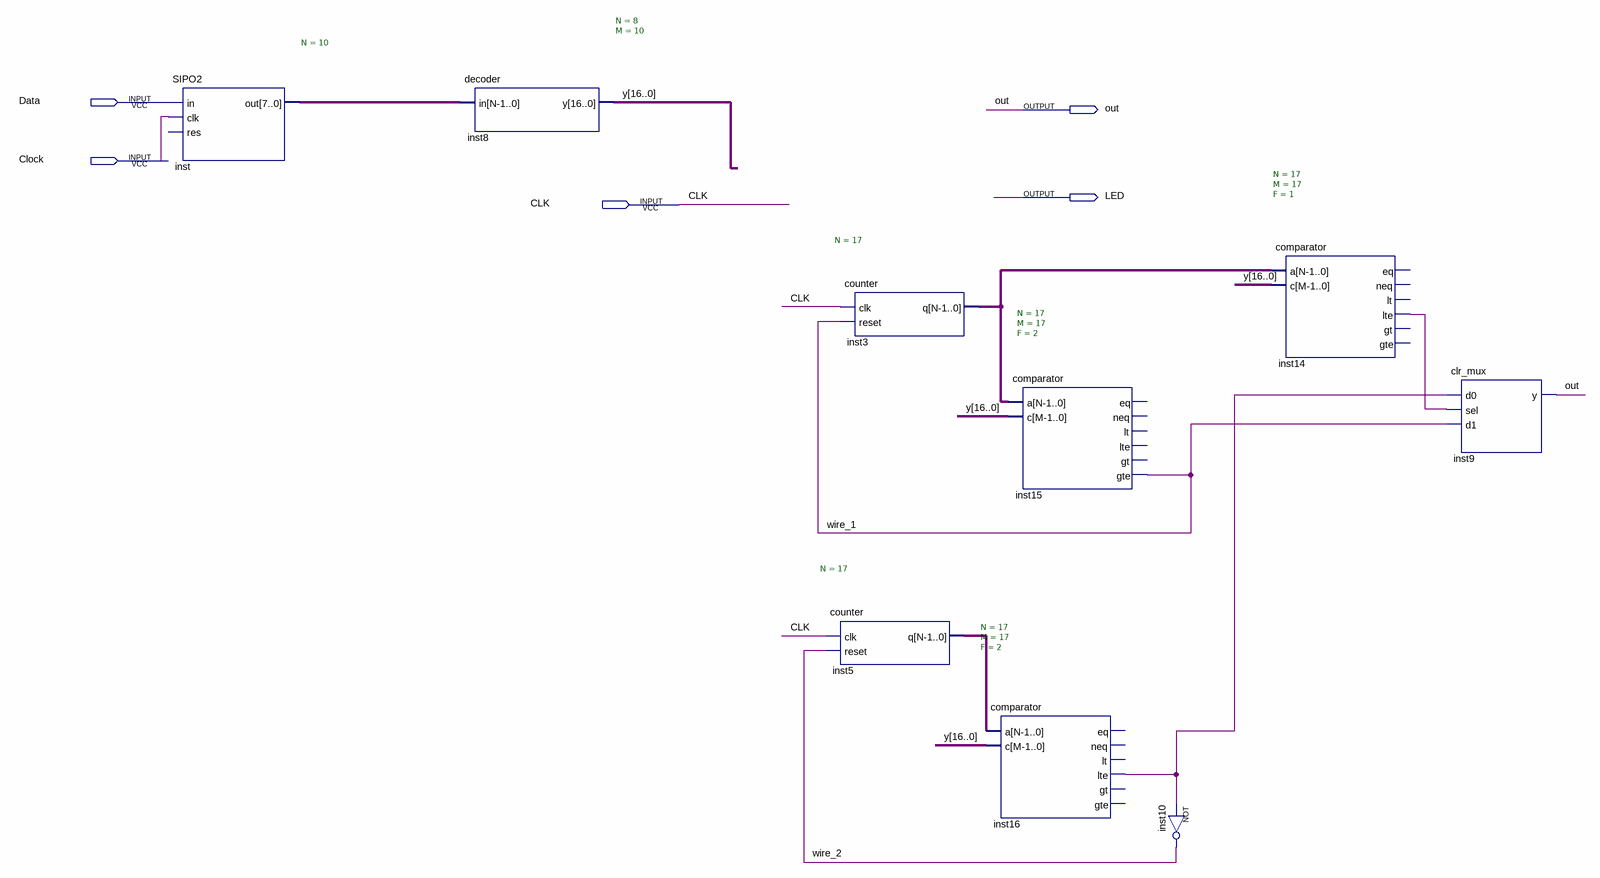
[diagram p0: schematic sheet]
// Quartus schematic Top_Level2.bdf as structural Verilog: 9 symbols, 5 pins
module Top_Level2 (
  input  Data,
  input  Clock,
  input  CLK,
  output out,
  output LED
);

  wire inst14_lte, inst16_lte, wire_1, wire_2;
  wire [7:0] inst_out;
  wire [16:0] inst3_q, inst5_q, y;

  SIPO2 #(.N(10)) inst (.in(Data), .clk(Clock), .out(inst_out));  // open: res
  decoder #(.N(8), .M(10)) inst8 (.in(inst_out), .y(y));
  counter #(.N(17)) inst3 (.clk(CLK), .reset(wire_1), .q(inst3_q));
  counter #(.N(17)) inst5 (.clk(CLK), .reset(wire_2), .q(inst5_q));
  comparator #(.N(17), .M(17), .F(2)) inst15 (.a(inst3_q), .c(y), .gte(wire_1));  // open: eq, neq, lt, lte, gt
  comparator #(.N(17), .M(17), .F(2)) inst16 (.a(inst5_q), .c(y), .lte(inst16_lte));  // open: eq, neq, lt, gt, gte
  not inst10 (wire_2, inst16_lte);
  comparator #(.N(17), .M(17), .F(1)) inst14 (.a(inst3_q), .c(y), .lte(inst14_lte));  // open: eq, neq, lt, gt, gte
  clr_mux inst9 (.d0(inst16_lte), .sel(inst14_lte), .d1(wire_1), .y(out));
endmodule
